# Altium schematic sheet [1]Supply.SchDoc
size A4; DocumentNumber: 2; SheetNumber: 2; SheetTotal: 5
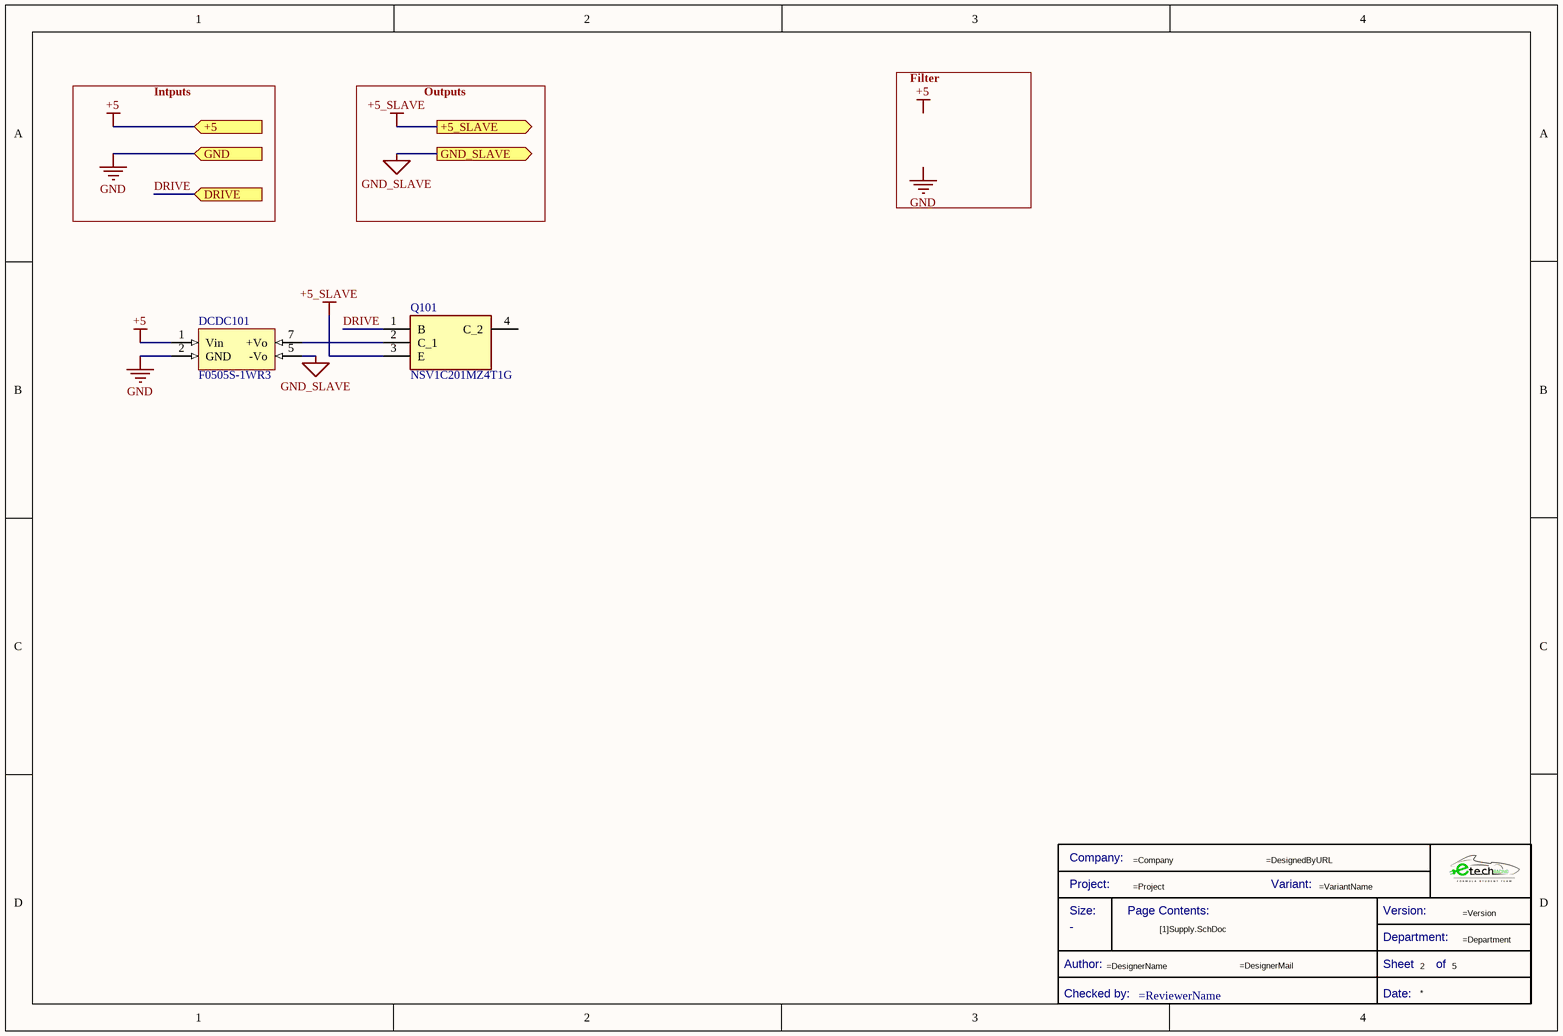
[diagram p0: [1]Supply.SchDoc]

## Parts
*?  Title Block_template  (value not drawn)  (graphical)
DCDC101  F0505S-1WR3  [F_S-1WR3]
Q101  NSV1C201MZ4T1G  [NSV1C201MZ4T1G]

## Ports
+5 (in), +5_SLAVE (out), DRIVE (in), GND (in), GND_SLAVE (out)

## Nets
+5: DCDC101.1(Vin) ; port +5
+5_SLAVE: Q101.3(E) ; port +5_SLAVE
GND: DCDC101.2(GND) ; port GND
GND_SLAVE: DCDC101.5(-Vo) ; port GND_SLAVE
DRIVE: Q101.1(B) ; port DRIVE
NetDCDC101_7: DCDC101.7(+Vo) Q101.2(C_1)

Not connected (* = marked no-connect by the designer): Q101 4(C_2)

## Notes on the sheet
- Intputs
- Outputs
- Filter
- Labels drawn without touching a wire or pin: +5, GND
- (in symbol Title Block_template) Company:; Project:; Variant:; Size:; Page Contents:; Version:; Department:; Author:; Sheet; of; Checked by:; Date:

## Library data of the parts
*? = Title Block_template: Standard Title Block; .Creator: GP; Category: Title Block; .PCBcheck: GP; .SCHcheck: GP; Checked by:: =ReviewerName; Size: -
DCDC101 = DCDC-5V/5V-0.2A
Q101 = TRT-NPN-2A-100V-0.8W-SOT